# Altium schematic sheet Sheet_Digital_Input_and_Relay.SchDoc
size A4; SheetNumber: 3; SheetTotal: 4
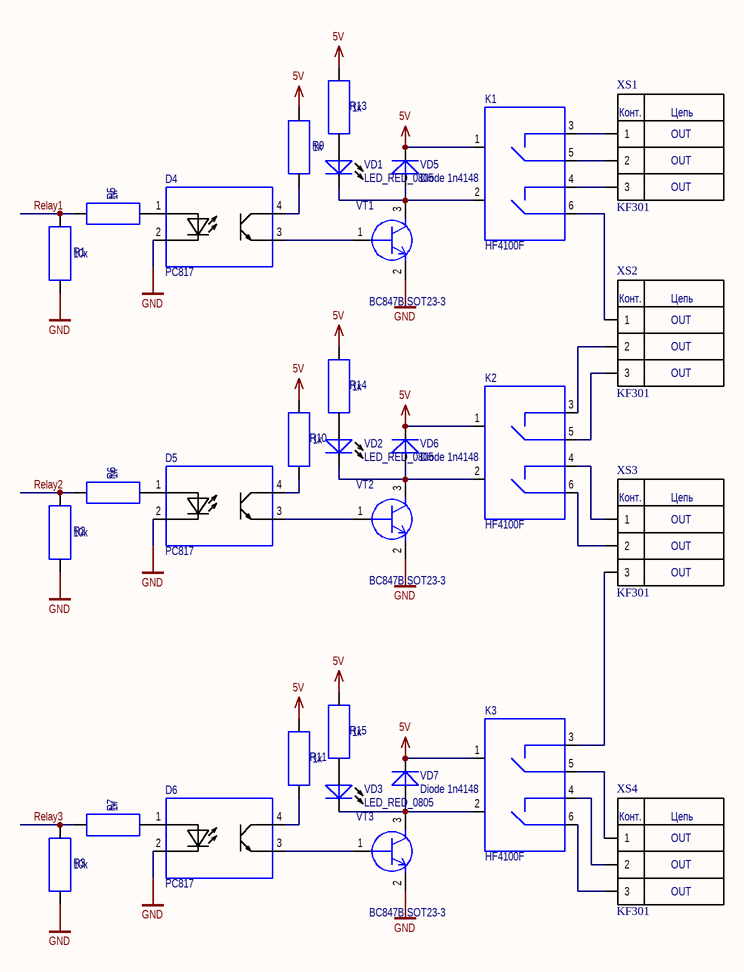
[diagram p0: Sheet_Digital_Input_and_Relay.SchDoc]

## Parts
D4  PC817  [DIP-4]
D5  PC817  [DIP-4]
D6  PC817  [DIP-4]
K1  HF4100F  [HK4100F]
K2  HF4100F  [HK4100F]
K3  HF4100F  [HK4100F]
R1  value 10к  [R0603]  (hidden comment: Resistor)
R2  value 10к  [R0603]  (hidden comment: Resistor)
R3  value 10к  [R0603]  (hidden comment: Resistor)
R5  value 1к  [R0603]  (hidden comment: Resistor)
R6  value 1к  [R0603]  (hidden comment: Resistor)
R7  value 1к  [R0603]  (hidden comment: Resistor)
R9  value 1к  [R0603]  (hidden comment: Resistor)
R10  value 1к  [R0603]  (hidden comment: Resistor)
R11  value 1к  [R0603]  (hidden comment: Resistor)
R13  value 1к  [R0603]  (hidden comment: Resistor)
R14  value 1к  [R0603]  (hidden comment: Resistor)
R15  value 1к  [R0603]  (hidden comment: Resistor)
VD1  LED_RED_0805  [VD0805]
VD2  LED_RED_0805  [VD0805]
VD3  LED_RED_0805  [VD0805]
VD5  Diode 1n4148  [SOD323]
VD6  Diode 1n4148  [SOD323]
VD7  Diode 1n4148  [SOD323]
VT1  BC847B SOT23-3  [INF-SOT23_M]
VT2  BC847B SOT23-3  [INF-SOT23_M]
VT3  BC847B SOT23-3  [INF-SOT23_M]
XS1  KF301  [KF301-5.08-3P]
XS2  KF301  [KF301-5.08-3P]
XS3  KF301  [KF301-5.08-3P]
XS4  KF301  [KF301-5.08-3P]

## Nets
5V: K1.1 K2.1 K3.1 R9.1 R10.1 R11.1 R13.1 R14.1 R15.1 VD5.2 VD6.2 VD7.2
GND: D4.2(Cathode) D5.2(Cathode) D6.2(Cathode) R1.2 R2.2 R3.2 VT1.2(E) VT2.2(E) VT3.2(E)
Relay1: R1.1 R5.1
Relay2: R2.1 R6.1
Relay3: R3.1 R7.1
NetD4_1: D4.1(Anode) R5.2
NetD4_3: D4.3(Emitter) VT1.1(B)
NetD4_4: D4.4(Collector) R9.2
NetD5_1: D5.1(Anode) R6.2
NetD5_3: D5.3(Emitter) VT2.1(B)
NetD5_4: D5.4(Collector) R10.2
NetD6_1: D6.1(Anode) R7.2
NetD6_3: D6.3(Emitter) VT3.1(B)
NetD6_4: D6.4(Collector) R11.2
NetK1_2: K1.2 VD1.2 VD5.1 VT1.3(K)
NetK1_3: K1.3 XS1.1
NetK1_4: K1.4 XS1.3
NetK1_5: K1.5 XS1.2
NetK1_6: K1.6 XS2.1
NetK2_2: K2.2 VD2.2 VD6.1 VT2.3(K)
NetK2_3: K2.3 XS2.2
NetK2_4: K2.4 XS3.1
NetK2_5: K2.5 XS2.3
NetK2_6: K2.6 XS3.2
NetK3_2: K3.2 VD3.2 VD7.1 VT3.3(K)
NetK3_3: K3.3 XS3.3
NetK3_4: K3.4 XS4.2
NetK3_5: K3.5 XS4.1
NetK3_6: K3.6 XS4.3
NetR13_2: R13.2 VD1.1
NetR14_2: R14.2 VD2.1
NetR15_2: R15.2 VD3.1

## Notes on the sheet
- (in symbol KF301) Конт.; Цепь; OUT

## Library data of the parts
D4-D6 = PC817: Manufacturer 1: UMW; Manufacturer Part Number 1: PC817C
R1-R3 = ОСМ Р1-12 -0,1- 10 кОм ± 5%: Manufacturer Part Number 1: RC0603FR-0710K; Manufacturer 1: YAGEO; Tolerance: ± 1% - М; Power: 0,1 Вт; Size: 0603
R5-R7 R9-R11 R13-R15 = ОСМ Р1-12 -0,1- 1 кОм ± 5%: Manufacturer Part Number 1: RC0603JR-071KL; Manufacturer 1: YAGEO; Tolerance: ± 1% - М; Power: 0,1 Вт; TU: АЛЯР.434110.005ТУ, РД В 22.02.218; Size: 0603; HelpURL: Datasheets\Р1-12.pdf
VD1-VD3 = LED_RED_0805: Manufacturer Part Number 1: KPHCM-2012SURCK; Manufacturer 1: Kingbright
VD5-VD7 = Diode 1n4148: Manufacturer Part Number 1: 1N4148WS; Manufacturer 1: Hottech
VT1-VT3 = BC847B SOT23-3: NPN Transistor; Manufacturer 1: Hottech; Part Number: BC847B SOT23-3; CompType: BC847B; Size: SOT23-3; Manufacturer Part Number 1: BC847B
XS1-XS4 = KF301: Manufacturer Part Number 1: KF301-5.0-3P; Manufacturer 1: CIXI SANHE